# EasyEDA schematic Микроконтроллер.json
TITLE: MK; REV: 1.0; Date: 2024-07-26; Sheet: 1/1; Drawn By: danik_mus; Company: Your Company
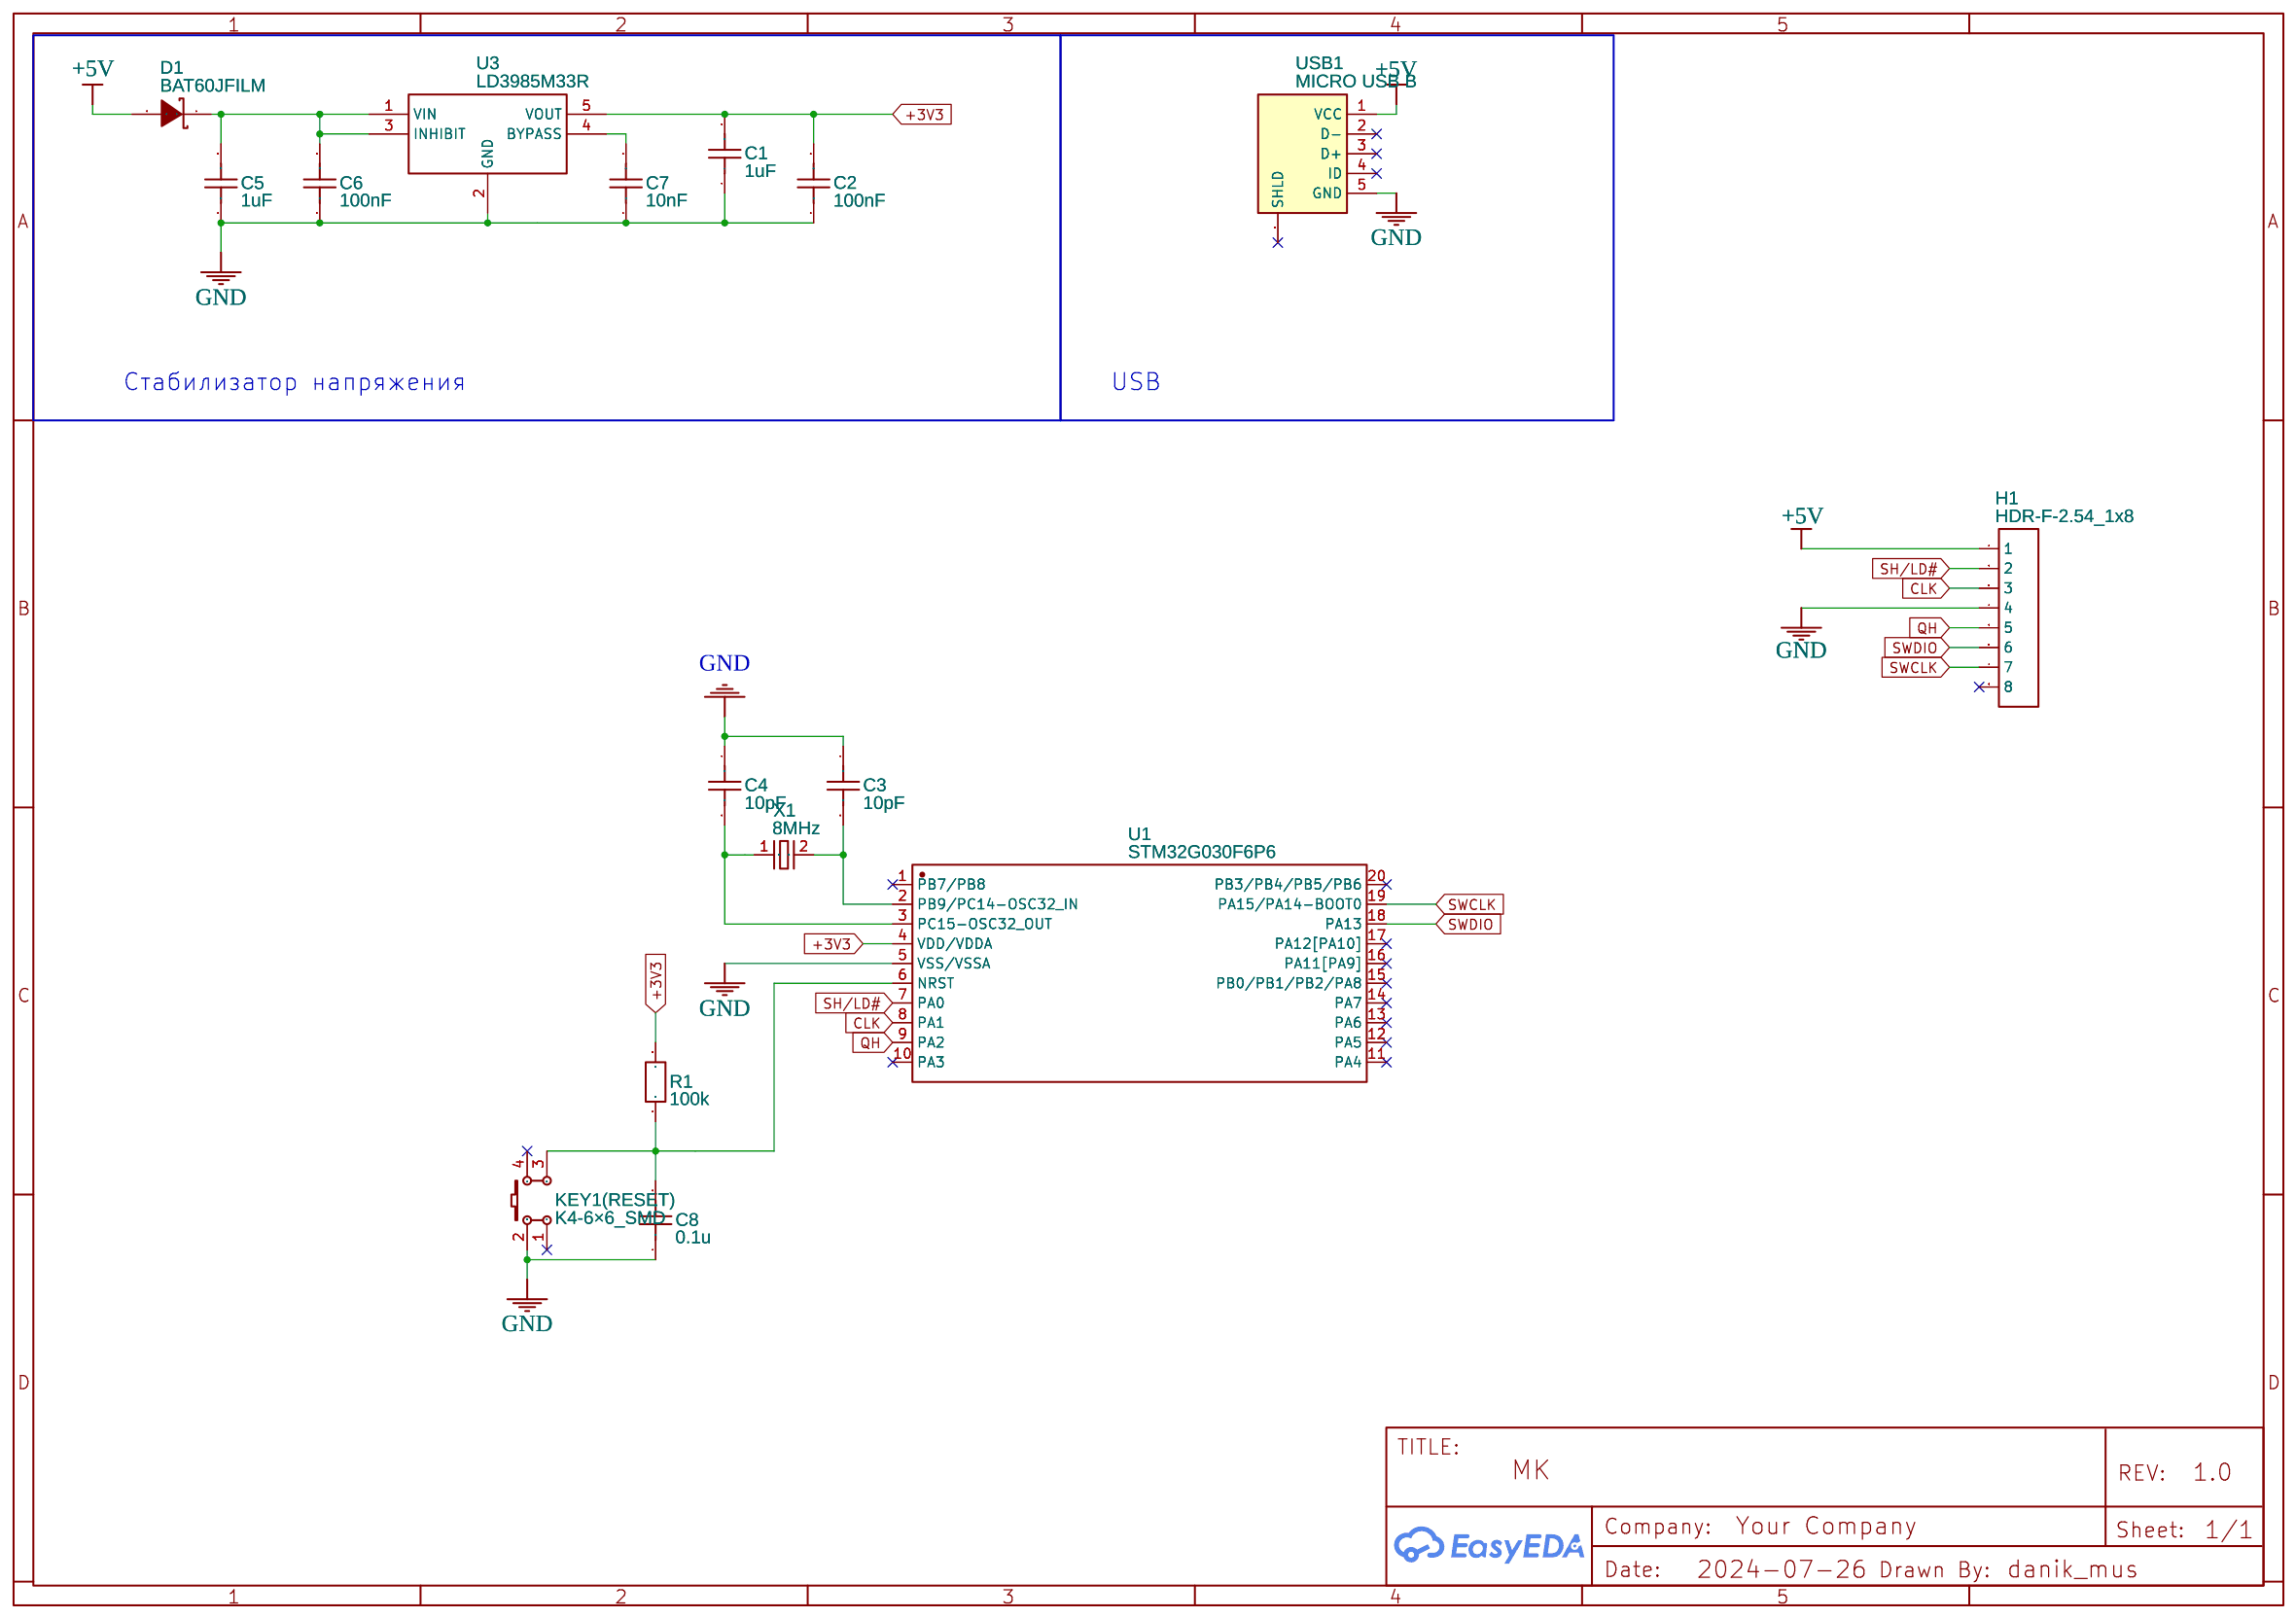
[diagram p0: schematic sheet]

## Parts
C1  1uF  [C0603]
C2  100nF  [C0603]
C3  10pF  [C0603]
C4  10pF  [C0603]
C5  1uF  [C0603]
C6  100nF  [C0603]
C7  10nF  [C0603]
C8  0.1u  [C0603]
D1  BAT60JFILM  [SOD-323_L1.8-W1.3-LS2.5-RD]
H1  HDR-F-2.54_1x8  [HDR-F-2.54_1X8]
KEY1(RESET)  K4-6×6_SMD  [KEY-SMD_4P-L6.0-W6.0-P3.90-LS10.0]
R1  100k  [R0603]
U1  STM32G030F6P6  [TSSOP-20_L6.5-W4.4-P0.65-LS6.4-BL]
U3  LD3985M33R  [SOT-23-5_L3.0-W1.7-P0.95-LS2.8-BR]
USB1  MICRO USB B  [GENERIC MICRO USB / MICRO-USB-SMD_MICRO-USB-16]
X1  8MHz  [OSC-SMD_2P-L3.2-W2.5]

## Library data of the parts
C1-C8 = C_0603_US: Contributor: LCEDA_Lib
D1 = BAT60JFILM: Contributor: LCSC; Supplier: LCSC; Manufacturer: ST(意法半导体); Supplier Part: C133103; JLCPCB Part Class: Extended Part
H1 = HDR-F-2.54_1x8: Supplier Part: C225505; Supplier: LCSC; Contributor: LCEDA_Lib
KEY1(RESET) = K4-6×6_SMD: Supplier Part: C191626; Supplier: LCSC; Manufacturer: 韩国韩荣; Manufacturer Part: K2-6639SP-D4SC-04; Contributor: LCEDA_Lib
R1 = R_0603_EU: Contributor: LCEDA_Lib
U1 = STM32G030F6P6: Contributor: LCSC; Supplier: LCSC; Supplier Part: C724040; Manufacturer: ST(意法半导体); JLCPCB Part Class: Extended Part
U3 = LD3985M33R: Supplier: LCSC; Manufacturer: ST(意法半导体); Supplier Part: C46243; JLCPCB Part Class: Extended Part
USB1 = MICRO USB B: Supplier: LCSC; Manufacturer: HRO; Manufacturer Part: U-F-M5SW-Y-3; Supplier Part: C106820; JLCPCB Part Class: Extended Part
X1 = NX3225GD-8MHZ-STD-CRA-3: Contributor: LCSC; Supplier: LCSC; Supplier Part: C889706; Manufacturer: NDK; JLCPCB Part Class: Extended Part

## Nets
+3V3: C1.2 C2.2 R1.2 U1.4(VDD/VDDA) U3.5(VOUT)
+5V: D1.2(A) H1.1 USB1.1(VCC)
GND: C1.1 C2.1 C3.1 C4.1 C5.1 C6.1 C7.1 C8.1 H1.4 KEY1(RESET).2 U1.5(VSS/VSSA) U3.2(GND) USB1.5(GND)
CLK: H1.3 U1.8(PA1)
QH: H1.5 U1.9(PA2)
SH/LD#: H1.2 U1.7(PA0)
SWCLK: H1.7 U1.19(PA15/PA14-BOOT0)
SWDIO: H1.6 U1.18(PA13)
Net-(C3-2): C3.2 U1.2(PB9/PC14-OSC32_IN) X1.2(GND)
Net-(C4-2): C4.2 U1.3(PC15-OSC32_OUT) X1.1
Net-(C5-2): C5.2 C6.2 D1.1(K) U3.1(VIN) U3.3(INHIBIT)
Net-(C7-2): C7.2 U3.4(BYPASS)
Net-(C8-2): C8.2 KEY1(RESET).3 R1.1 U1.6(NRST)

Not connected (* = marked no-connect by the designer): H1 8*; KEY1(RESET) 1* 4*; U1 1(PB7/PB8)* 10(PA3)* 11(PA4)* 12(PA5)* 13(PA6)* 14(PA7)* 15(PB0/PB1/PB2/PA8)* 16(PA11[PA9])* 17(PA12[PA10])* 20(PB3/PB4/PB5/PB6)*; USB1 2(D-)* 3(D+)* 4(ID)* 6(SHLD)*

## Notes on the sheet
- Стабилизатор напряжения
- USB
